# Altium schematic sheet Power.SchDoc: Power
size A; Author: Tim Jager; DrawnBy: Tim Jager; Engineer: Tim Jager
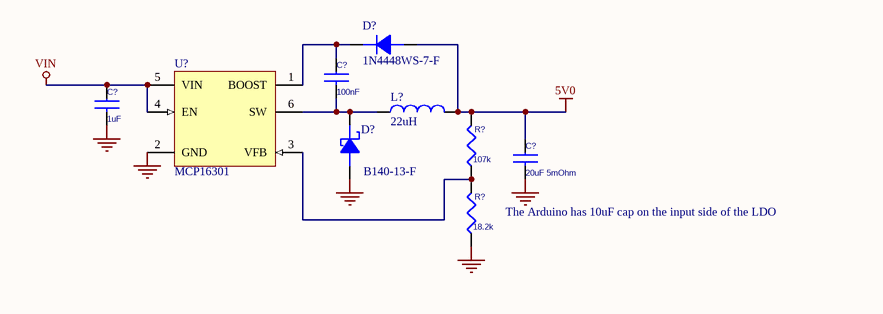
[diagram p0: Power.SchDoc]

## Parts
(Parts that share a designator on the sheet are numbered #1, #2 ... from top to bottom, then left to right.)
C?#1  100nF
C?#2  1uF
C?#3  20uF 5mOhm
D?#1  1N4448WS-7-F  [1N4448WS-7-F]
D?#2  B140-13-F  [DO-214AC SMA]
L?  22uH  [SRN5040-220M]
R?#1  107k  [RESC1608N]
R?#2  18.2k  [RESC1608N]
U?  MCP16301  [MCP16301]

## Nets
5V0: C?#3.1 D?#1.A L?.2 R?#1.2
GND: C?#2.2 C?#3.2 D?#2.A R?#2.1 U?.2(GND)
VIN: C?#2.1 U?.4(EN) U?.5(VIN)
NetC?#1_1: C?#1.1 D?#1.K U?.1(BOOST)
NetC?#1_2: C?#1.2 D?#2.K L?.1 U?.6(SW)
NetR?#1_1: R?#1.1 R?#2.2 U?.3(VFB)

## Notes on the sheet
- The Arduino has 10uF cap on the input side of the LDO
- Title
- Date:
- Project
- Sheet:
- Company
- File:
- Author:

## Library data of the parts
C?#1-C?#3 = CAP NP: Capacitor Ceramic *%
D?#1 = 1N4448WS-7-F: DIODE GEN PURP 75V 250MA SOD323; Supplier 1: Digi-Key; Supplier Part Number 1: 1N4448WS-FDICT-ND
D?#2 = B140-13-F: DIODE SCHOTTKY 40V 1A SMA; Supplier 1: Digi-Key; Supplier Part Number 1: B140-FDICT-ND
L? = Inductor: 145mOhm; Supplier 1: Digi-Key; Supplier Part Number 1: SRN5040-220MCT-ND
R?#1 R?#2 = RES: Resistor 1%
U? = MCHP-MCP16301-SOT-23-6: IC REG BUCK ADJ 0.6A SOT23-6; Supplier 1: Digi-Key; Supplier Part Number 1: MCP16301HT-E/CHDKR-ND